# Altium schematic sheet Payload.SchDoc
size 381 x 241 mm; SheetNumber: 1; SheetTotal: 1
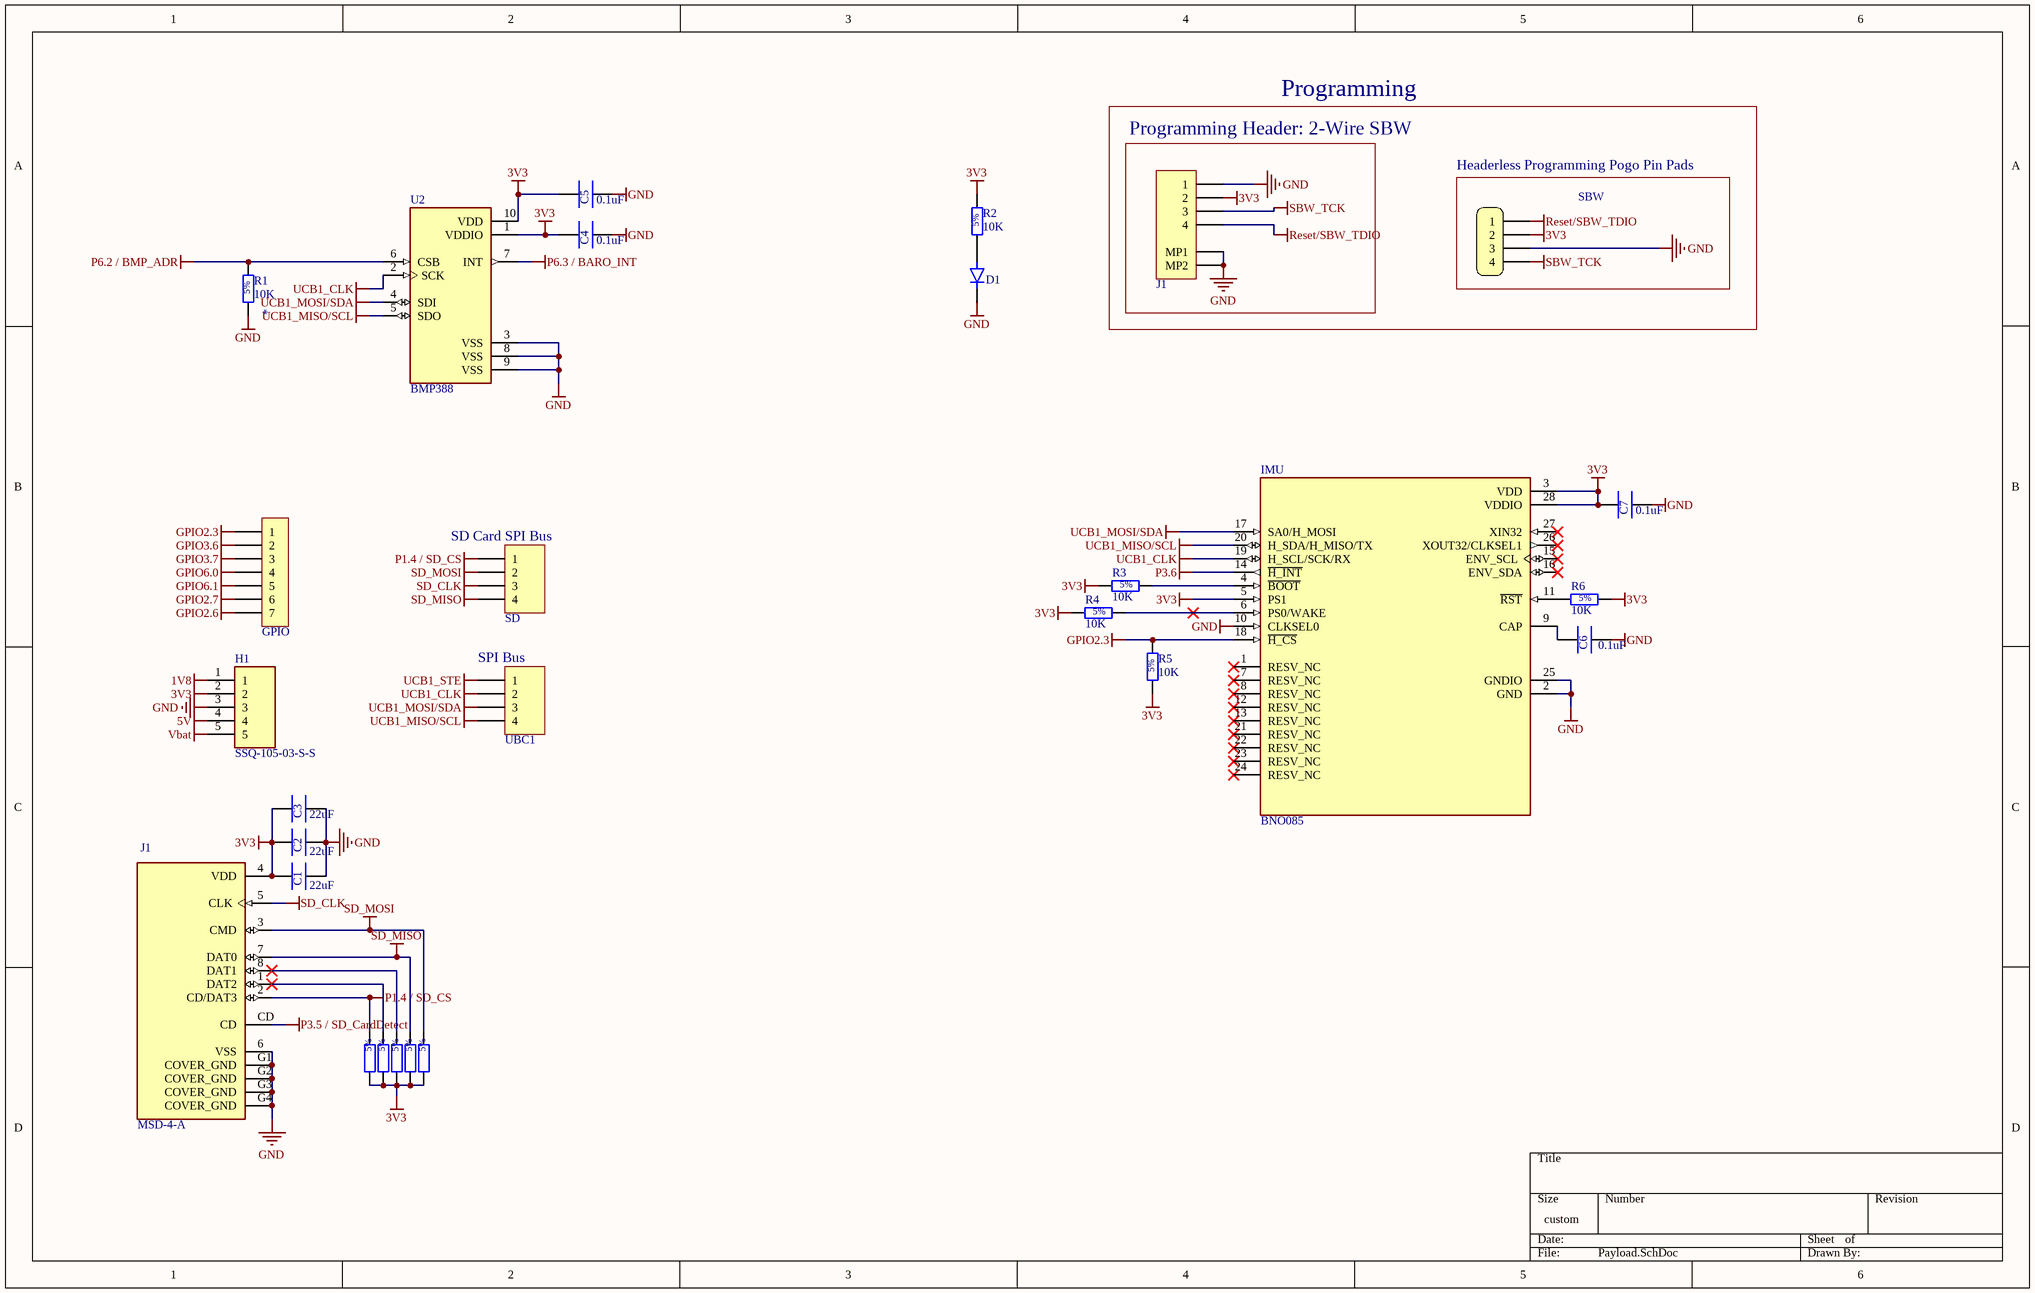
[diagram p0: Payload.SchDoc]

## Parts
(Parts that share a designator on the sheet are numbered #1, #2 ... from top to bottom, then left to right.)
C1  22uF  [CAPACITOR_0805_2012M-70N]
C2  22uF  [CAPACITOR_0805_2012M-70N]
C3  22uF  [CAPACITOR_0805_2012M-70N]
C4  0.1uF  [CAPACITOR_0805_2012M-70N]
C5  0.1uF  [CAPACITOR_0805_2012M-70N]
C6  0.1uF  [CAPACITOR_0805_2012M-70N]
C7  0.1uF  [CAPACITOR_0805_2012M-70N]
D1  1N4148W-TP  [SOD123-1.35mm-N]  (value not drawn)
GPIO  0530470710  [HEADER_2.54MM_1x7PIN]  (value not drawn)
H1  SSQ-105-03-S-S  [HEADER_2.54MM_1x5PIN]
IMU  BNO085  [IC_BNO085]
J1#1  5015680407  [MOLEX_5013310407]  (value not drawn)
J1#2  MSD-4-A  [CUI_MSD-4-A]
PP?  Headerless Pogo Holes 4-pin  [POGO_4_PIN_HEADER]  (value not drawn)  (no BOM)
R1  10K  [Resistor_0805_2012M-50N]
R2  10K  [RESC1607X60N]
R3  10K  [Resistor_0805_2012M-50N]
R4  10K  [Resistor_0805_2012M-50N]
R5  10K  [Resistor_0805_2012M-50N]
R6  10K  [Resistor_0805_2012M-50N]
R7  4.7k  [Resistor_0805_2012M-50N]  (value not drawn)
R8  4.7k  [Resistor_0805_2012M-50N]  (value not drawn)
R9  4.7k  [Resistor_0805_2012M-50N]  (value not drawn)
R10  4.7k  [Resistor_0805_2012M-50N]  (value not drawn)
R11  4.7k  [Resistor_0805_2012M-50N]  (value not drawn)
SD  Header 4  [HEADER_2.54MM_1x4PIN]  (value not drawn)
U2  BMP388  [PQFN50P200X200X80-10N]
UBC1  Header 4  [HEADER_2.54MM_1x4PIN]  (value not drawn)

## Blocks framed on the sheet
Programming Header: 2-Wire SBW: J1#1
Headerless Programming Pogo Pin Pads: PP?

## Nets
1V8: H1.1
3V3: C1.2 C2.2 C3.2 C4.2 C5.2 C7.2 H1.2 IMU.3(VDD) IMU.5(PS1) IMU.28(VDDIO) J1#1.2 J1#2.4(VDD) PP?.2 R2.2 R3.1 R4.1 R5.1 R6.2 R7.2 R8.2 R9.2 R10.2 R11.2 U2.1(VDDIO) U2.10(VDD)
5V: H1.4
GND: C1.1 C2.1 C3.1 C4.1 C5.1 C6.1 C7.1 D1.C H1.3 IMU.2(GND) IMU.10(CLKSEL0) IMU.25(GNDIO) J1#1.1 J1#1.MP1 J1#1.MP2 J1#2.6(VSS) J1#2.G1(COVER_GND) J1#2.G2(COVER_GND) J1#2.G3(COVER_GND) J1#2.G4(COVER_GND) PP?.3 R1.1 U2.3(VSS) U2.8(VSS) U2.9(VSS)
GPIO2.3: GPIO.1 IMU.18(~{H_CS}) R5.2
GPIO2.6: GPIO.7
GPIO2.7: GPIO.6
GPIO3.6: GPIO.2
GPIO3.7: GPIO.3
GPIO6.0: GPIO.4
GPIO6.1: GPIO.5
P1.4 / SD_CS: J1#2.2(CD/DAT3) R7.1 SD.1
P3.5 / SD_CardDetect: J1#2.CD
P3.6: IMU.14(~{H_INT})
P6.2 / BMP_ADR: R1.2 U2.6(CSB)
P6.3 / BARO_INT: U2.7(INT)
Reset/SBW_TDIO: J1#1.4 PP?.1
SBW_TCK: J1#1.3 PP?.4
SD_CLK: J1#2.5(CLK) SD.3
SD_MISO: J1#2.7(DAT0) R10.1 SD.4
SD_MOSI: J1#2.3(CMD) R11.1 SD.2
UCB1_CLK: IMU.19(H_SCL/SCK/RX) U2.2(SCK) UBC1.2
UCB1_MISO/SCL: IMU.20(H_SDA/H_MISO/TX) U2.5(SDO) UBC1.4
UCB1_MOSI/SDA: IMU.17(SA0/H_MOSI) U2.4(SDI) UBC1.3
UCB1_STE: UBC1.1
Vbat: H1.5
NetC6_2: C6.2 IMU.9(CAP)
NetD1_A: D1.A R2.1
NetIMU_4: IMU.4(~{BOOT}) R3.2
NetIMU_6: IMU.6(PS0/WAKE) R4.2
NetIMU_11: IMU.11(~{RST}) R6.1
NetJ1#2_1: J1#2.1(DAT2) R8.1
NetJ1#2_8: J1#2.8(DAT1) R9.1

Not connected (* = marked no-connect by the designer): IMU 1(RESV_NC)* 7(RESV_NC)* 8(RESV_NC)* 12(RESV_NC)* 13(RESV_NC)* 15(ENV_SCL)* 16(ENV_SDA)* 21(RESV_NC)* 22(RESV_NC)* 23(RESV_NC)* 24(RESV_NC)* 26(XOUT32/CLKSEL1)* 27(XIN32)*

## Notes on the sheet
- Programming
- SBW
- (near SD) SD Card SPI Bus
- (near UBC1) SPI Bus

## Library data of the parts
C1-C7 = GRM21BR61C226ME44L: Passive - Capacitor, X5R, 22uF Max, 16V, 0805 (2012 Metric), ±20%, -55°C ~ 85°C. 9.4uF @ 5V, 3.2uF @ 15V, 1.9uF @ 25V; APSS Standard Part: APSS Standard; Capacitance at Rated Voltage: 10%; Tolerance: ±20%; Temperature Coefficient: X5R; Rated Voltage: 16V; Temp Range: -55°C ~ 85°C; Package: 0805; Supplier 1: Digikey; Supplier 1 Part No.: 490-10747-1-ND; MF Part No.: GRM21BR61C226ME44L
  C1-C3: Value: 22uF
  C4-C7: Value: 0.1uF
D1 = 1N4148W-TP: Diode - Low Reverse Leakage, 1.25 Vf @ 150 mA, 1 µA Reverse @ 75 V, SOD-123; APSS Standard Part: APSS Standard; Temp Range: -65°C ~ 150°C; Rated Voltage: 100V Reverse; MF Part No.: 1N4148W-TP; Package: SOD-123; Supplier 1: Digikey; Supplier 1 Part No.: 1N4148WTPMSCT-ND
GPIO = 0530470710: Connector - Picoblade 07-pin, TH, STR; APSS Standard Part: APSS Standard; Pitch: 1.25mm; Mounting Type: Through-hole; Orientation: Straight; MF Part No.: 0530470710; Pins: 7; Supplier 1: Digikey; Supplier 1 Part No.: WM1736-ND
H1 = SSQ-105-03-S-S: MF: {'manufacturer': u'Samtec Inc.'}; Package: None; Price: None; Value: *; MP: SSQ-105-03-S-S; Availability: Unavailable
IMU = BNO085: Accelerometer, Gyroscope, Magnetometer, 9 Axis Sensor IÂ²C, SPI, UART Output; MF: Hillcrest Laboratories,; SnapEDA_Link: https://www.snapeda.com/parts/BNO085/Hillcrest+Laboratories%252C+Inc./view-part/?ref=snap; Package: TFLGA-28 Hillcrest Laboratories; Value: *; MP: BNO085; Check_prices: https://www.snapeda.com/parts/BNO085/Hillcrest+Laboratories%252C+Inc./view-part/?ref=eda
J1#1 = 5015680407: Connector - Picoclasp  04-pin, SMT, RA; APSS Standard Part: APSS Standard; Pitch: 1mm; Mounting Type: Surface Mount; Orientation: Straight; MF Part No.: 5015680407; Pins: 4; Supplier 1: Digikey; Supplier 1 Part No.: WM7895CT-ND
J1#2 = MSD-4-A: Micro SD Card Connector, 9 Positions, Connector and Ejector, Push In, Auto Eject Out, Surface Mount, 1.8 mm Height Above Board, Gold Flash; MF: Same Sky; SnapEDA_Link: https://www.snapeda.com/parts/MSD-4-A/Same+Sky/view-part/?ref=snap; Package: None; Value: *; MP: MSD-4-A; Check_prices: https://www.snapeda.com/parts/MSD-4-A/Same+Sky/view-part/?ref=eda
R1-R6 = RMCF0805JT Series: Passive - Resistor Series, 0805, 5%, 100m - 22M, E24, 0.063W, 1/16W, ±200ppm/°C, -55°C ~ 155°C, 0805 (2012 Metric); APSS Standard Part: APSS Standard; Power: 1/8W; Value Range: 100m ~ 22M; Rated Voltage: 150V; Tolerance: 5%; E Series: E24; Temp Range: -55°C ~ 155°C; Supplier 1: Digikey; Package: 0805; Temperature Coefficient: ±200ppm/°C; Value: 10K
  R1: MF Part No.: *
R7-R11 = RMCF0805JT Series: Passive - Resistor Series, 0805, 5%, 100m - 22M, E24, 0.063W, 1/16W, ±200ppm/°C, -55°C ~ 155°C, 0805 (2012 Metric); MF Part No.: RMCF0805JT1K00; APSS Standard Part: APSS Standard; Power: 1/8W; Value Range: 100m ~ 22M; Rated Voltage: 150V; Tolerance: 5%; E Series: E24; Temp Range: -55°C ~ 155°C; Supplier 1: Digikey; Package: 0805; Temperature Coefficient: ±200ppm/°C; Value: 4.7k
SD UBC1 = Header 4: Header, 4-Pin
U2 = BMP388: P-Sensor SPI I2C 1, 25 Bar SMD; Package: None; Price: None; Value: *; MP: BMP388; Availability: Unavailable